# EAGLE design mp3431-boost-tester-mk-1.1 (EAGLE 9.3.1)
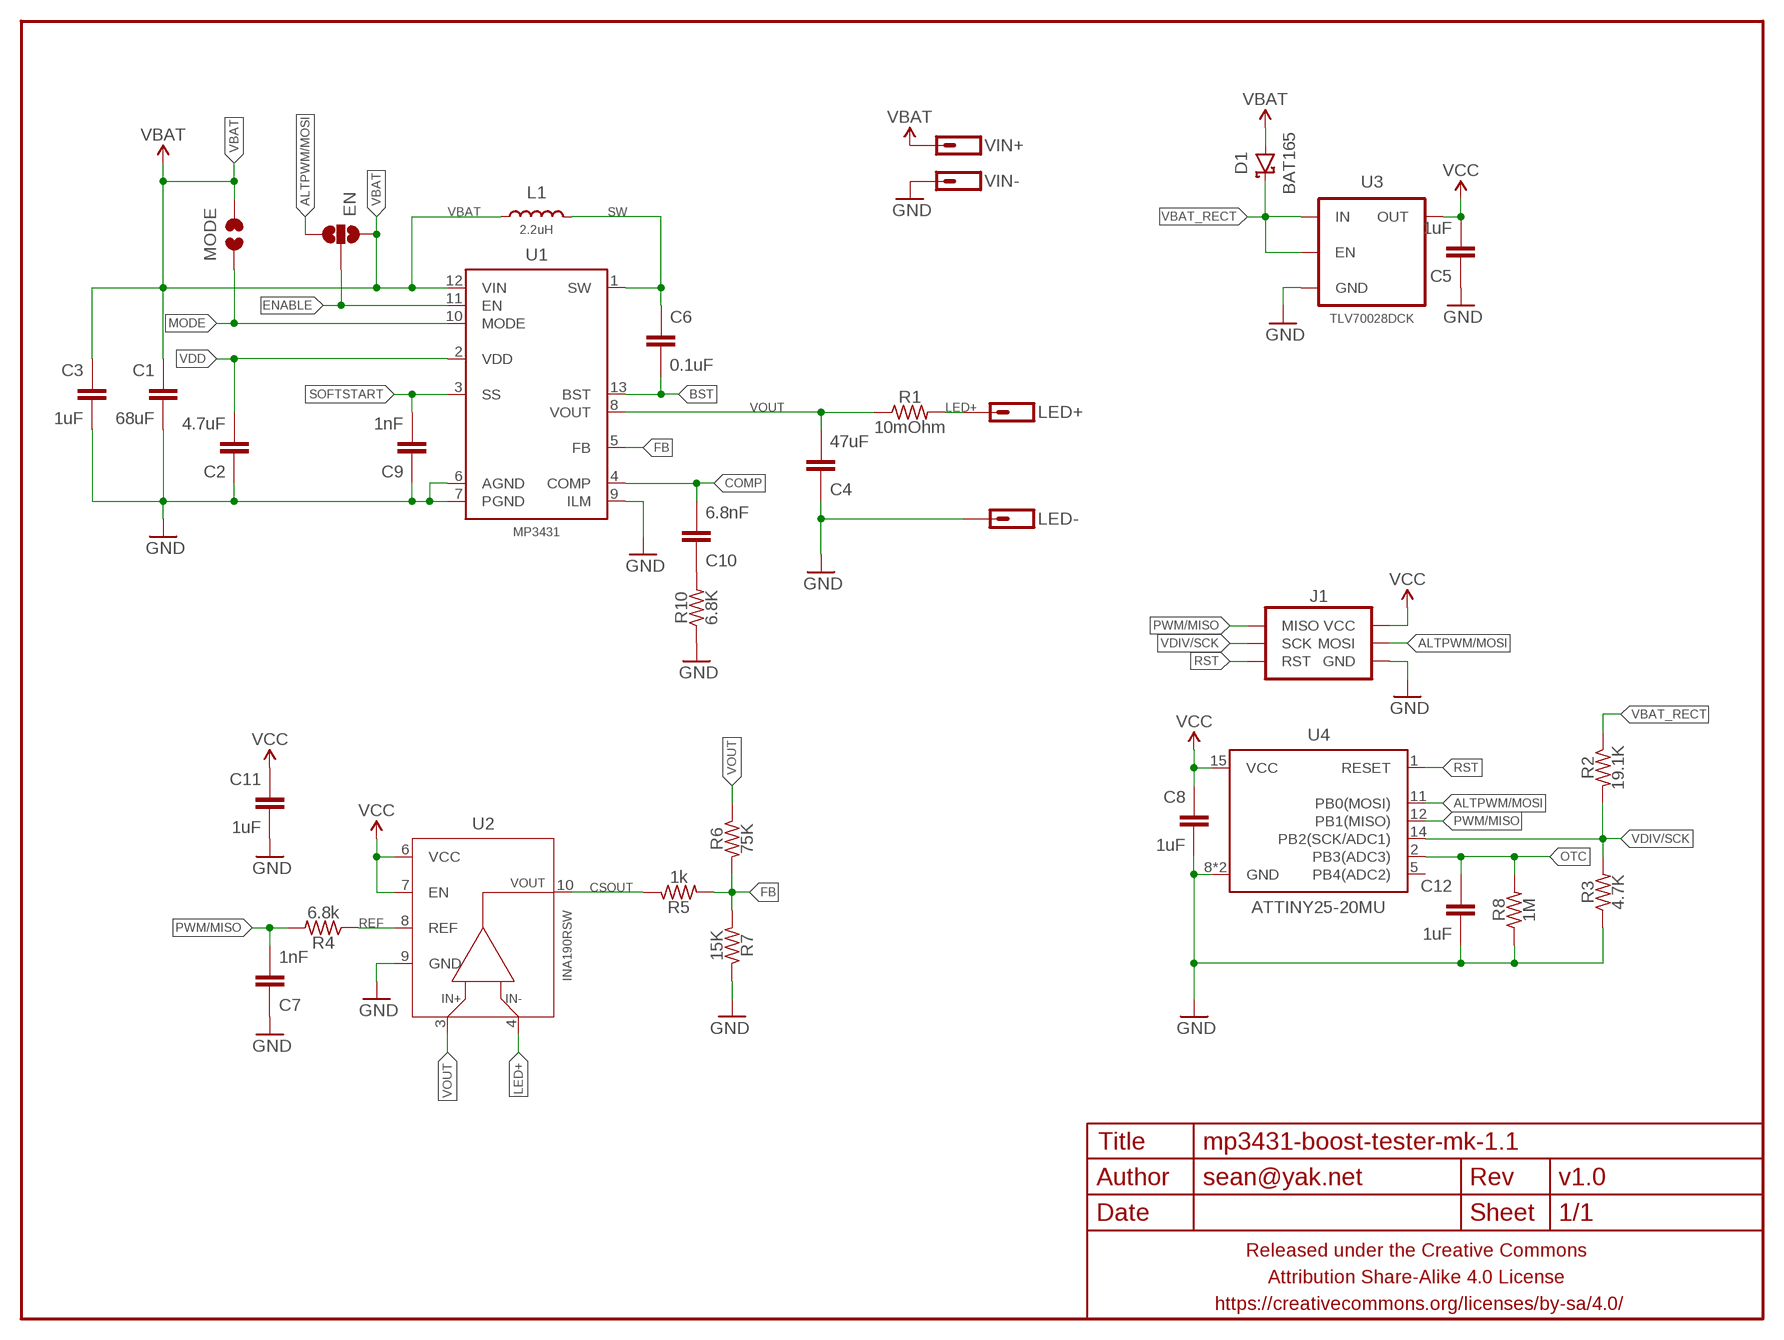
[diagram p0: schematic, sheet 1]

## Parts
C1  68uF  CAPACITOR-CERAMICC1210  [C1210]
C2  4.7uF  CAPACITOR-CERAMICC0402  [C0402]
C3  1uF  CAPACITOR-CERAMICC0402  [C0402]
C4  47uF  CAPACITOR-CERAMICC1210  [C1210]
C5  1uF  CAPACITOR-CERAMICC0402  [C0402]
C6  0.1uF  CAPACITOR-CERAMICC0402  [C0402]
C7  1nF  CAPACITOR-CERAMICC0402  [C0402]
C8  1uF  CAPACITOR-CERAMICC0402  [C0402]
C9  1nF  CAPACITOR-CERAMICC0402  [C0402]
C10  6.8nF  CAPACITOR-CERAMICC0402  [C0402]
C11  1uF  CAPACITOR-CERAMICC0402  [C0402]
C12  1uF  CAPACITOR-CERAMICC0402  [C0402]
D1  BAT165  DIODE-SCHOTTKYSOD323  [SOD323-SCHOTTKY]
EN  JUMPER-PAD-3-NOSMALL_BOX_SILK  [PAD-JUMPER-3-NO_YES_SILK_SMALL_BOX]
FRAME1  FRAME-LETTERNO_PACKAGE  [DUMMY]
J1  AVR_SPI_PRG_6PTH  [2X3]
L1  2.2uH  INDUCTORXAL7070  [XAL7070]
LED+  M01PTH-1.2MM-NS  [1X01-1.2MM-NS]
LED-  M01PTH-1.2MM-NS  [1X01-1.2MM-NS]
MODE  JUMPER-PAD-2-NOYES_SILK  [PAD-JUMPER-2-NO_YES_SILK]
R1  10mOhm  RESISTORR1206  [R1206]
R2  19.1K  RESISTORR0402  [R0402]
R3  4.7K  RESISTORR0402  [R0402]
R4  6.8k  RESISTORR0402  [R0402]
R5  1k  RESISTORR0402  [R0402]
R6  75K  RESISTORR0402  [R0402]
R7  15K  RESISTORR0402  [R0402]
R8  1M  RESISTORR0402  [R0402]
R10  6.8K  RESISTORR0402  [R0402]
U1  MP3431  [MP3431]
U2  INA190RSW  [UQFN-10]
U3  TLV70028DCK  V_REG_ENTLV700XXDCR  [SC70]
U4  ATTINY25-20MU  ATTINY45TINY85-20-QFN  [QFN20]
VIN+  M01PTH-1.2MM-NS  [1X01-1.2MM-NS]
VIN-  M01PTH-1.2MM-NS  [1X01-1.2MM-NS]

## Nets
ALTPWM/MOSI: EN.3 J1.4(MOSI) U4.11(PB0(MOSI))
BST: C6.2 U1.13(BST)
COMP: C10.2 U1.4(COMP)
COMP_MID: C10.1 R10.2
CSOUT: R5.1 U2.10(OUT)
ENABLE: EN.2 U1.11(EN)
FB: R5.2 R6.2 R7.2 U1.5(FB)
GND: C1.2 C2.1 C3.2 C4.1 C5.1 C7.1 C8.2 C9.1 C11.2 C12.2 J1.6(GND) LED-.P$1 R3.1 R7.1 R8.1 R10.1 U1.6(AGND) U1.7(PGND) U1.9(ILM) U2.9(GND) U3.2(GND) U4.8(GND) U4.PAD(GND) VIN-.P$1
LED+: LED+.P$1 R1.2 U2.4(VIN-)
MODE: MODE.1 U1.10(MODE)
OTC: C12.1 R8.2 U4.2(PB3(ADC3))
PWM/MISO: C7.2 J1.1(MISO) R4.2 U4.12(PB1(MISO))
REF: R4.1 U2.8(REF)
RST: J1.5(RST) U4.1(RESET)
SOFTSTART: C9.2 U1.3(SS)
SW: C6.1 L1.P$2 U1.1(SW)
VBAT: C1.1 C3.1 D1.A EN.1 L1.P$1 MODE.2 U1.12(VIN) VIN+.P$1
VBAT_RECT: D1.C R2.1 U3.1(IN) U3.3(EN)
VCC: C5.2 C8.1 C11.1 J1.2(VCC) U2.6(VCC) U2.7(EN) U3.5(OUT) U4.15(VCC)
VDD: C2.2 U1.2(VDD)
VDIV/SCK: J1.3(SCK) R2.2 R3.2 U4.14(PB2(SCK/ADC1))
VOUT: C4.2 R1.1 R6.1 U1.8(VOUT) U2.3(VIN+)
Unconnected: U4.5(PB4(ADC2))

## Library data of the parts
C1-C12 = a_parts:CAPACITOR-CERAMIC: CAPACITOR, European symbol
D1 = a_parts:DIODE-SCHOTTKY: Schottky diodes in SFE's production catalog BAT20J 1A 23V 0.62Vf RB751 120mA 40V 0.37Vf PMEG4005EJ 0.5A 40V 0.42Vf MBRA140 1A 40V 0.5Vf B340A 3A 40V SMA
EN = a_parts:JUMPER-PAD-3-NO
FRAME1 = a_parts:FRAME-LETTER: Schematic Frame Standard 8.5x11 US Letter frame; DESIGNER: sean@yak.net; VERSION: v1.0
J1 = a_parts:AVR_SPI_PRG_6: AVR ISP 6 Pin This is the reduced ISP connector for AVR programming. Common on Arduino. This footprint will take up less PCB space and can be used with a 10-pin to 6-pin adapter such as SKU: BOB-08508 **Special note about "TEST_POINT" package. The stop mask is on the top side, so if you want your programming test points to be on the bottom of your board, make sure to place this package on the bottom side of the board. This also ensure that the orientation to program from the bottom side will be correct.
L1 = a_parts:INDUCTOR: Inductors Basic Inductor/Choke - 0603 and 1206. Footprints are not proven and vary greatly between part numbers. SRN6045- 33uH, 20% 1.4A SDR0403-560KL - 56uH, 10%, 500mA RMS/740mA peak
LED+ LED- VIN+ VIN- = a_parts:M01: Header 1 Standard 1-pin 0.1" header. Use with straight break away headers (SKU : PRT-00116), right angle break away headers (PRT-00553), swiss pins (PRT-00743), machine pins (PRT-00117), and female headers (PRT-00115).
MODE = a_parts:JUMPER-PAD-2-NO
R1-R8 R10 = a_parts:RESISTOR: RESISTOR, American symbol
U1 = a_parts:MP3431
U2 = a_parts:INA190
U3 = a_parts:V_REG_EN
U4 = a_parts:ATTINY45: Atmel 8-pin 2/4/8kB flash uC

## Board
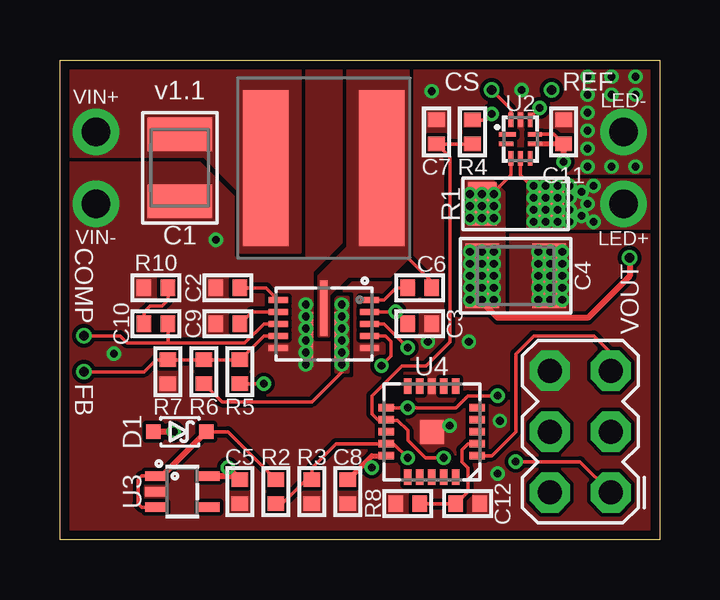
[diagram p1: board, top side]
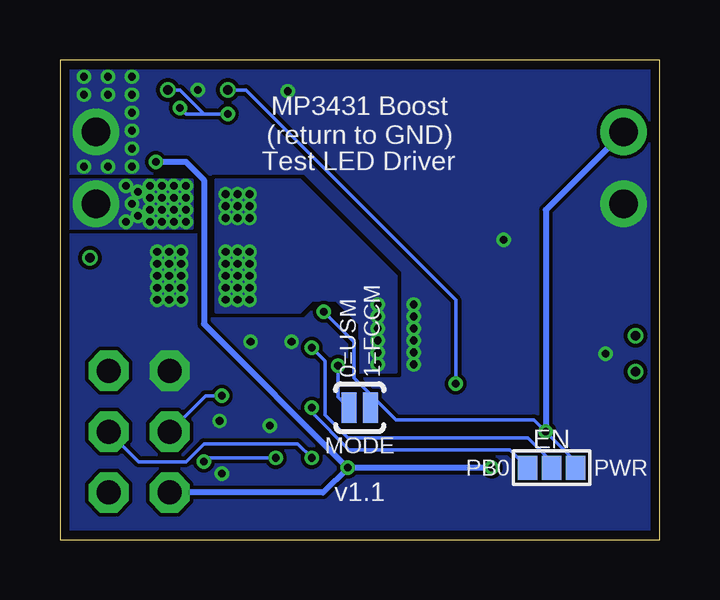
[diagram p2: board, bottom side, seen from below]

Size 25 x 20 mm. Coordinates in mm from the lower left corner, seen from the top.
Outline: 25,20 25,0 0,0 0,20 25,20
Copper layers (1*16): Top 0.035559375mm / dielectric 1.6mm / Bottom 0.035559375mm
Design rules "oshpark-2layer *": minimum track width 6mil, minimum drill 10mil, track to track 6mil, track to pad 6mil, pad to pad 6mil, via to via 6mil, smd to smd 0mil, copper to edge 15mil, drill to drill 6mil, minimum pad ring 5mil, minimum via ring 5mil, stop-mask expansion 2.5mil, vias tented up to drill 0.39mm, thermal gap 10mil
tRestrict: area 18.8,12.8 to 19.2,15

### Footprints (pad centres in the part's own frame; a part is rotated, then mirrored left to right if it is on the bottom)
C1210 = smd 1.4 x 2.7: 1 -1.4,0; 2 1.4,0
C0402 = smd 0.6 x 0.7: 1 -0.5,0; 2 0.5,0
SOD323-SCHOTTKY = smd 0.6 x 0.6: A -1.1,0; C 1.1,0
PAD-JUMPER-3-NO_YES_SILK_SMALL_BOX = smd 0.8 x 1: 1 -1,0; 2 0,0; 3 1,0
2X3 = drill 1 pad 1.676 octagon: 1 -2.54,-1.27; 2 -2.54,1.27; 3 0,-1.27; 4 0,1.27; 5 2.54,-1.27; 6 2.54,1.27
XAL7070 = smd 1.9 x 6.5: P$1 -2.41,0; P$2 2.41,0
1X01-1.2MM-NS = drill 1.2 pad 1.93: P$1 0,0
PAD-JUMPER-2-NO_YES_SILK = smd 0.635 x 1.27: 1 -0.45,0; 2 0.45,0
R1206 = smd 1.2 x 1.8: 1 -1.4,0; 2 1.4,0
R0402 = smd 0.6 x 0.7: 1 -0.5,0; 2 0.5,0
MP3431 = smd 2.3 x 0.3: 1 -0.65,0; 7 0.65,-0.6; 8 0.65,0.6 | smd 0.25 x 0.8: 2 -1,-1.9; 3 -0.5,-1.9; 4 0,-1.9; 5 0.5,-1.9; 6 1,-1.9; 9 1,1.9; 10 0.5,1.9; 11 0,1.9; 12 -0.5,1.9; 13 -1,1.9
UQFN-10 = smd 0.2 x 0.7: 1 -0.2,-0.55 | smd 0.2 x 0.6: 2 0.2,-0.6; 6 0.2,0.6; 7 -0.2,0.6 | smd 0.6 x 0.2: 3 0.8,-0.4; 4 0.8,0; 5 0.8,0.4; 8 -0.8,0.4; 9 -0.8,0; 10 -0.8,-0.4
SC70 = smd 0.4 x 0.9: 1 -0.65,-1.1; 2 0,-1.1; 3 0.65,-1.1; 4 0.65,1.1; 5 -0.65,1.1
QFN20 = smd 0.65 x 0.3: 1 -1.9,1; 2 -1.9,0.5; 3 -1.9,0; 4 -1.9,-0.5; 5 -1.9,-1; 11 1.9,-1; 12 1.9,-0.5; 13 1.9,0; 14 1.9,0.5; 15 1.9,1 | smd 0.3 x 0.65: 6 -1,-1.9; 7 -0.5,-1.9; 8 0,-1.9; 9 0.5,-1.9; 10 1,-1.9; 16 1,1.9; 17 0.5,1.9; 18 0,1.9; 19 -0.5,1.9; 20 -1,1.9 | smd 1 x 1: PAD 0,0

### Placement (x,y rotation side)
C1  5,15.5 270 top
C2  7,10.5 0 top
C3  15,9 0 top
C4  19,11 180 top
C5  7.5,2 90 top
C6  15,10.5 180 top
C7  15.7,17 270 top
C8  12,2 270 top
C9  7,9 0 top
C10  4,9 0 top
C11  21,17 90 top
C12  17,1.5 0 top
D1  5,4.5 0 top
EN  4.5,3 180 bottom
FRAME1  0,0 270 top
J1  21.7,4.5 90 top
L1  11,15.5 0 top
LED+  23.5,14 90 top
LED-  23.5,17 270 top
MODE  12.5,5.5 0 bottom
R1  19,14 0 top
R2  9,2 270 top
R3  10.5,2 90 top
R4  17.2,17 270 top
R5  7.5,7 90 top
R6  6,7 90 top
R7  4.5,7 90 top
R8  14.5,1.5 0 top
R10  4,10.5 0 top
U1  11,9 270 top
U2  19.2,16.7 270 top
U3  5.1,2 270 top
U4  15.5,4.5 180 top
VIN+  1.5,17 270 top
VIN-  1.5,14 270 top

### Tracks (layer width: path | path; a pad name or v marks a point on that pad's centre or on a via)
ALTPWM/MOSI  (via drill 0.33)
  Top 0.152: U4.11 v14.5,5.5 16.5,5.5 17,6 v18.25,6
  Bottom 0.152: EN.3 6.25,3.75 12.95,3.75 14.5,5.3 v14.5,5.5 | v18.25,6 18.93,6 J1.4
BST
  Top 0.152: U1.13 13.5,10 14,10.5 C6.2
COMP  (via drill 0.4)
  Top 0.152: U1.4 8.5,9 7.7,8.2 4.5,8.2 | v1,8.5 2.5,8.5 2.8,8.2 4.5,8.2 | C10.2 4.5,8.2
COMP_MID
  Top 0.152: C10.1 3.5,9.5 3.75,9.75 4.25,9.75 4.5,10 R10.2
CSOUT  (via drill 0.33, 0.4)
  Top 0.152: U2.10 18.8,17.95 v18,18.75 | R5.1 v8.5,6.5
  Bottom 0.152: v18,18.75 17.25,18.75 8.5,10 v8.5,6.5
ENABLE  (via drill 0.33)
  Top 0.152: U1.11 13.5,9 v14.5,8
  Bottom 0.152: v14.5,8 13.95,7.45 13.95,5.2 13,4.25 5.5,4.25 4.5,3.25 EN.2
FB  (via drill 0.4)
  Top 0.152: U1.5 8.5,8.5 R5.2 R6.2 R7.2 4,7.5 3.5,7 v1,7
GND  (via drill 0.33)
  other vias: 10.25,9.3 10.25,8.8 10.25,8.3 10.25,7.8 10.25,7.3 10.25,9.8 19.25,18.75 15.35,8.25 16.25,4.75 6.5,12.5 15.5,18.7 17.05,8.25 19.95,10 20.45,10 20.95,10 19.95,10.5 20.45,10.5 20.95,10.5 20.95,11 20.45,11 19.95,11 19.95,11.5 20.45,11.5 20.95,11.5 20.95,12 20.45,12 19.95,12 22,18.55 22,19.3 23,18.55 23,19.3 24,18.55 24,19.3 22,15.55 23,15.55 24,15.55 22,16.3 22,17.8 22,17.05 18.25,2.75 2.25,7.75 18.35,4.95
  pour Top (rank 6, no thermals): 0,0 0,20 25,20 25,0
  pour Bottom (rank 6, no thermals): 25,0 25,20 0,20 0,0
LED+  (via drill 0.33)
  Top 0.152: R1.2 19.2,15.2 U2.4
  other vias: 19.75,13.25 19.75,13.75 19.75,14.25 19.75,14.75 20.25,13.25 20.25,13.75 20.25,14.25 20.25,14.75 20.75,14.75 20.75,14.25 20.75,13.75 20.75,13.25 21.75,13.5 22.25,13.25 22,14 21.75,14.5 22.25,14.75 21.25,13.25 21.25,13.75 21.25,14.25 21.25,14.75
  pour Top (rank 5, no thermals): 19.5,15 25,15 25,13 19.5,13
  pour Bottom (rank 5, no thermals): 25,15 19.5,15 19.5,13 25,13
MODE  (via drill 0.33)
  Top 0.152: U1.10 13.57,8.5 13.8,8.27 13.8,7.65 v13.4,7.25
  Bottom 0.152: v13.4,7.25 13.4,5.95 MODE.1
OTC
  Top 0.152: U4.2 17,4 16.75,3.75 16.75,3.25 17,3 17,2 C12.1 R8.2
PWM/MISO  (via drill 0.33)
  Top 0.152: R4.2 C7.2 16.25,15.95 16.25,8.25 15.25,7.25 14.25,7.25 13,6 13,5.25 13.25,5 U4.12 13.62,4.98 14.07,4.98 14.5,4.54 14.5,4.13 15.24,3.4 v16,3.4 | v19,3.25 21.68,3.25 J1.1
  Bottom 0.152: v16,3.4 18.85,3.4 v19,3.25
REF  (via drill 0.33, 0.4)
  Top 0.152: U2.8 19.6,17.6 v20,18 | v18,17.75 17.75,17.5 R4.1
  Bottom 0.152: v20,18 19.75,17.75 19,17.75 | v18,17.75 19,17.75 | 19,17.75 20,18.75 v20.5,18.75
RST
  Top 0.152: U4.1 18,3.5 19,4.5 19,7.75 19.75,8.5 22.25,8.5 23,7.75 23,7.07 J1.5
SOFTSTART
  Top 0.152: U1.3 8,9.5 C9.2
SW
  Top 0.152: C6.1 15.5,10.75 14.5,11.75
  pour Top (rank 4, no thermals): 10.8,8.5 10.8,11 12,12.2 12,20 14.5,20 14.5,11.75 13.75,11 12,11 11.2,10.2 11.2,8.5
VBAT  (via drill 0.33)
  Top 0.152: U1.12 v14,9.5 C3.1
  Top 0.25: v4.75,4.5 D1.A
  Bottom 0.152: 11.75,5.75 11,5 5.25,5 v4.75,4.5 3.5,3.25 EN.1 | 11.75,5.75 12.75,6.75 12.75,8.25 v14,9.5 | MODE.2 12,5.5 11.75,5.75
  Bottom 0.25: VIN+.P$1 4.75,13.75 v4.75,4.5
  pour Top (rank 5, no thermals): 0,16 6,16 7.5,14.5 7.5,12 10,12 10,20 0,20
VBAT_RECT
  Top 0.152: D1.C 7,4.5 R2.1 | U3.3 3.4,1.35 3.25,1.5 3.25,2.5 3.4,2.65 U3.1
  Top 0.25: D1.C 4.25,2.65 U3.1
VCC  (via drill 0.33)
  Top 0.152: U2.7 20.6,16.9 C11.1
  Top 0.2: C8.1 12.75,3.25 | 12.75,3.25 13,3.5 U4.15 | v13,3 12.75,3.25 | C11.1 U2.6
  Top 0.25: U3.5 7.35,2.65 | 7.35,2.65 C5.2 | 7.35,2.65 v7,3 | v21,15.75 C11.1
  Bottom 0.25: v13,3 14.04,1.96 J1.2 | v7,3 v13,3 | v13,3 | v21,15.75 19.75,15.75 19,15 19,9 v13,3
VDD
  Top 0.152: U1.2 8.6,10.5 C2.2
VDIV/SCK  (via drill 0.33)
  Top 0.152: R2.2 9.25,1.5 10.25,2.5 R3.2 10.5,3 11.5,4 U4.14 13.9,4 v14.5,3.4
  Bottom 0.152: v14.5,3.4 15.1,4 19,4 19.75,3.25 21.72,3.25 J1.3
VOUT  (via drill 0.33, 0.4)
  Top 0.152: R1.1 18.8,15.2 U2.3 | R6.1 6.75,5.75 10.5,5.75 11.75,7 v11.75,7.3
  Top 0.25: C4.2 v17.6,11.5 17.6,9.9 18.25,9.25 22,9.25 23.75,11 v23.75,11.75
  other vias: 11.75,9.3 11.75,8.8 11.75,8.3 11.75,7.8 11.75,9.8 17.1,10 17.6,10 18.1,10 17.1,10.5 17.6,10.5 18.1,10.5 18.1,11 17.6,11 17.1,11 17.1,11.5 18.1,11.5 18.1,12 17.6,12 17.1,12 17.1,13.4 17.6,13.4 18.1,13.4 17.1,13.9 17.1,14.4 17.6,13.9 18.1,13.9 17.6,14.4 18.1,14.4
  pour Bottom (rank 5, no thermals): 11,11 11,7 12.5,7 12.5,9 13.5,10 14.5,10 15,9.5 18.5,9.5 18.5,15 15,15
  pour Top (rank 5, no thermals): 16.75,9.5 18.5,9.5 18.5,14.5 18,15 16.75,15
  pour Top (rank 5, no thermals): 11.5,10.1 11.5,7 12,7 12,10.1

### Text on the board
tPlace: CS | REF | VOUT | COMP | FB
bPlace: MP3431 Boost / (return to GND) | Test LED Driver | 1=FCCM | 0=USM | PWR | PB0